# Altium schematic sheet Coverpage.SchDoc: uStepper S-lite
size A3; DrawnBy: Mogens Groth Nicolaisen; DocumentNumber: 1; SheetNumber: 1; SheetTotal: 7
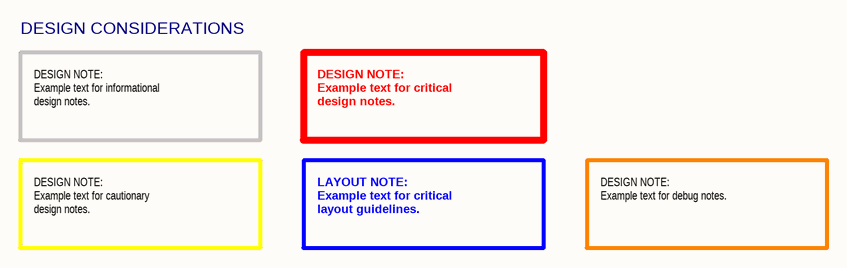
[diagram p0: Coverpage.SchDoc]

## Notes on the sheet
- DESIGN CONSIDERATIONS
- DESIGN NOTE:
  Example text for informational
  design notes.
- DESIGN NOTE:
  Example text for critical
  design notes.
- DESIGN NOTE:
  Example text for cautionary
  design notes.
- LAYOUT NOTE:
  Example text for critical
  layout guidelines.
- DESIGN NOTE:
  Example text for debug notes.
- ON Development
- Title:
- Size:
- A3
- Drawn By:
- Date:
- Sheet
- of
- Revision: